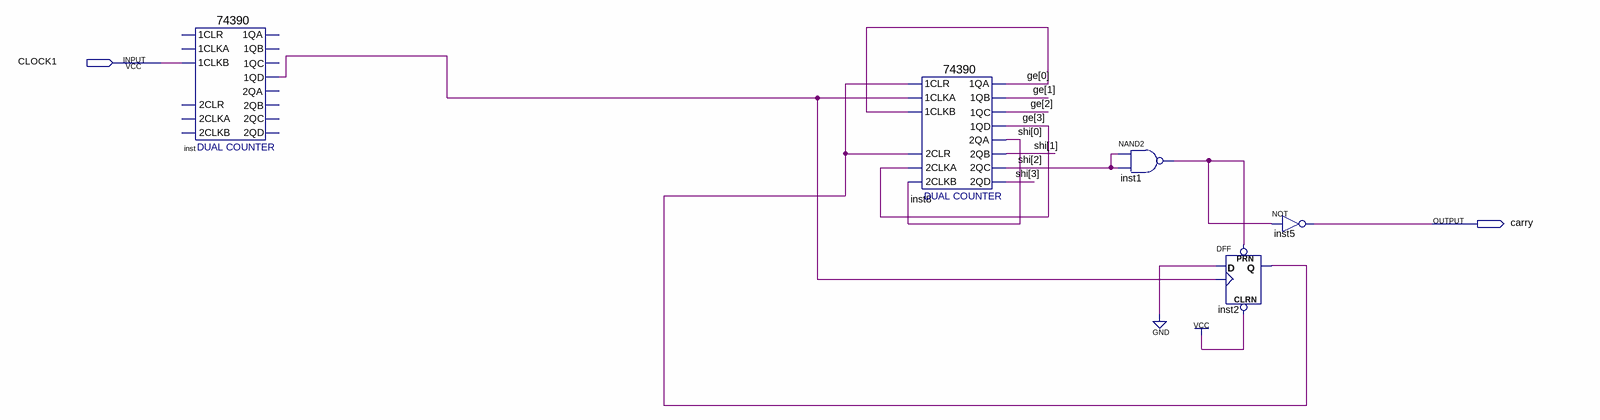
[diagram p0: schematic sheet]
// Quartus schematic 7seg_display_cnt10.bdf as structural Verilog: 5 symbols, 2 pins
module \7seg_display_cnt10  (
  input  CLOCK1,
  output carry
);

  wire inst1_out, inst2_q, inst_1qd;
  wire [3:0] ge, shi;

  \74390  inst (
    .\1CLKB (CLOCK1), .\1QD (inst_1qd));  // open: 2CLKA, 2CLR, 2CLKB, 1CLR, 1CLKA, 1QA, 1QB, 1QC, 2QA, 2QB, 2QC, 2QD
  \74390  inst8 (
    .\2CLKA (ge[3]), .\2CLR (inst2_q), .\2CLKB (shi[0]), .\1CLR (inst2_q), .\1CLKA (inst_1qd),
    .\1CLKB (ge[0]), .\1QA (ge[0]), .\1QB (ge[1]), .\1QC (ge[2]), .\1QD (ge[3]), .\2QA (shi[0]),
    .\2QB (shi[1]), .\2QC (shi[2]), .\2QD (shi[3]));
  nand inst1 (inst1_out, shi[2], shi[2]);
  DFF inst2 (.CLRN(1'b1), .CLK(inst_1qd), .D(1'b0), .PRN(inst1_out), .Q(inst2_q));
  not inst5 (carry, inst1_out);
endmodule
